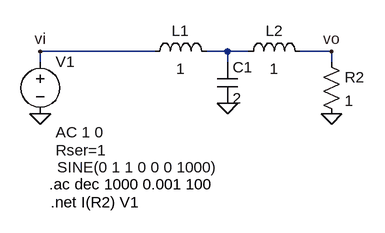
[diagram p0: schematic Draft1.asc]
Draft1.asc, the LTspice schematic file:
Version 4
SHEET 1 880 680
WIRE 176 112 0 112
WIRE 288 112 256 112
WIRE 320 112 288 112
WIRE 448 112 400 112
WIRE 0 128 0 112
WIRE 288 128 288 112
WIRE 448 128 448 112
FLAG 0 208 0
FLAG 288 192 0
FLAG 448 208 0
FLAG 0 112 vi
FLAG 448 112 vo
SYMBOL voltage 0 112 R0
WINDOW 3 26 178 Left 2
WINDOW 123 24 124 Left 2
WINDOW 39 24 152 Left 2
SYMATTR InstName V1
SYMATTR Value SINE(0 1 1 0 0 0 1000)
SYMATTR Value2 AC 1 0
SYMATTR SpiceLine Rser=1
SYMBOL ind 160 128 R270
WINDOW 0 32 56 VTop 2
WINDOW 3 5 56 VBottom 2
SYMATTR InstName L1
SYMATTR Value 1
SYMBOL cap 272 128 R0
SYMATTR InstName C1
SYMATTR Value 2
SYMBOL ind 304 128 R270
WINDOW 0 32 56 VTop 2
WINDOW 3 5 56 VBottom 2
SYMATTR InstName L2
SYMATTR Value 1
SYMBOL res 432 112 R0
SYMATTR InstName R2
SYMATTR Value 1
TEXT 16 344 Left 2 !.net I(R2) V1
TEXT 14 316 Left 2 !.ac dec 1000 0.001 100

The netlist it stands for:
* Draft1.asc
V1 vi 0 SINE(0 1 1 0 0 0 1000) AC 1 0 Rser=1
L1 vi N001 1
C1 N001 0 2
L2 N001 vo 1
R2 vo 0 1
.net I(R2) V1
.ac dec 1000 0.001 100
.backanno
.end